# EAGLE design attiny85nightlight (EAGLE 8.1.0)
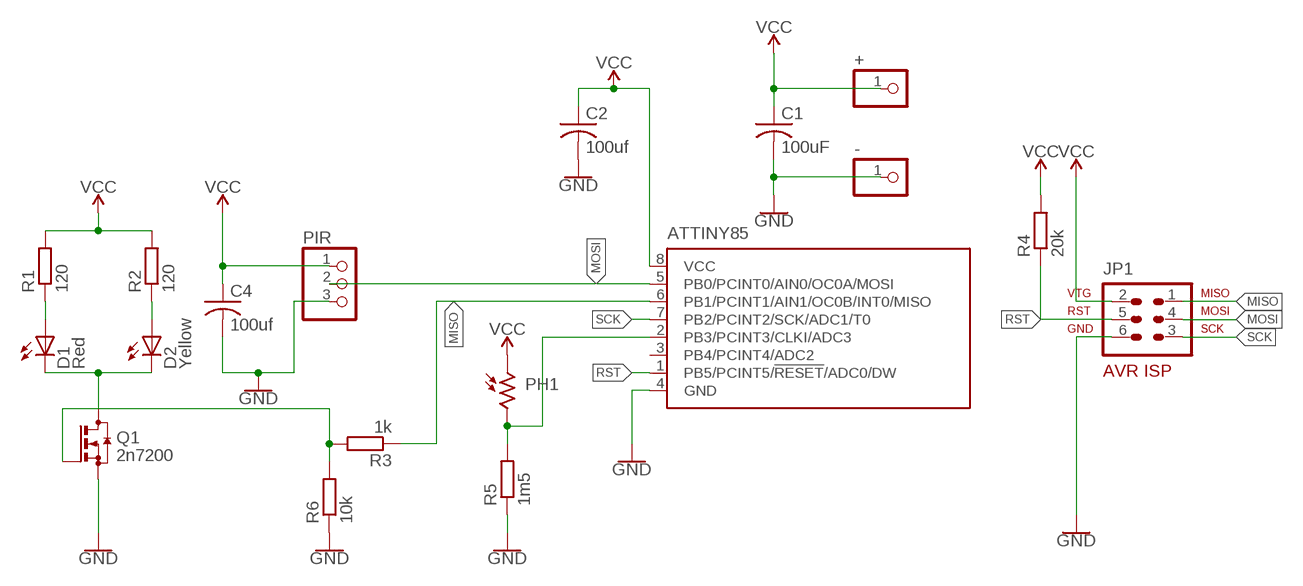
[diagram p0: schematic, sheet 1]

## Parts
+  PINHD-1X1  [1X01]
-  PINHD-1X1  [1X01]
ATTINY85  TINY13-20SU  [8S2]
C1  100uF  C-USC0805  [C0805]
C2  100uf  C-USC0805  [C0805]
C4  100uf  C-USC0805  [C0805]
D1  Red  LED5MM  [LED5MM]
D2  Yellow  LED5MM  [LED5MM]
JP1  AVR-ISP-6  [AVR-ISP-6]
PH1  A1050_09  [T0-46-A10XX]
PIR  PINHD-1X3  [1X03]
Q1  2n7200  BSS123  [SOT23]
R1  120  R-EU_R0805  [R0805]
R2  120  R-EU_R0805  [R0805]
R3  1k  R-EU_R0805  [R0805]
R4  20k  R-EU_R0805  [R0805]
R5  1m5  R-EU_R0805  [R0805]
R6  10k  R-EU_R0805  [R0805]

## Nets
GND: -.1 ATTINY85.4(GND) C1.2 C2.2 C4.2 JP1.6 PIR.3 Q1.2(S) R5.1 R6.1
MISO: ATTINY85.6(PB1/PCINT1/AIN1/OC0B/INT0/MISO) JP1.1 R3.1
MOSI: ATTINY85.5(PB0/PCINT0/AIN0/OC0A/MOSI) JP1.4 PIR.2
N$1: D1.K(C) D2.K(C) Q1.3(D)
N$3: ATTINY85.2(PB3/PCINT3/CLKI/ADC3) PH1.2 R5.2
N$5: D1.A R1.1
N$6: D2.A R2.1
N$8: Q1.1(G) R3.2 R6.2
RST: ATTINY85.1(PB5/PCINT5/!RESET!/ADC0/DW) JP1.5 R4.1
SCK: ATTINY85.7(PB2/PCINT2/SCK/ADC1/T0) JP1.3
VCC: +.1 ATTINY85.8(VCC) C1.1 C2.1 C4.1 JP1.2 PH1.1 PIR.1 R1.2 R2.2 R4.2
Unconnected: ATTINY85.3(PB4/PCINT4/ADC2)

## Library data of the parts
+ - = pinhead:PINHD-1X1: PIN HEADER
ATTINY85 = atmel:TINY13: 8-bit AVR Microcontroller with 1K Bytes In-System Programmable Flash Source: http://www.atmel.com/dyn/resources/prod_documents/2535S.pdf; MPN: ATTINY13-20SU; OC_FARNELL: 9171568; OC_NEWARK: 96K6522
C1 C2 C4 = rcl:C-US: CAPACITOR, American symbol
D1 D2 = led:LED: LED OSRAM: - CHIPLED LG R971, LG N971, LY N971, LG Q971, LY Q971, LO R971, LY R971 LH N974, LH R974 LS Q976, LO Q976, LY Q976 LO Q996 - Hyper CHIPLED LW Q18S LB Q993, LB Q99A, LB R99A - SideLED LS A670, LO A670, LY A670, LG A670, LP A670 LB A673, LV A673, LT A673, LW A673 LH A674 LY A675 LS A676, LA A676, LO A676, LY A676, LW A676 LS A679, LY A679, LG A679 - Hyper Micro SIDELED® LS Y876, LA Y876, LO Y876, LY Y876 LT Y87S - SmartLED LW L88C, LW L88S LB L89C, LB L89S, LG L890 LS L89K, LO L89K, LY L89K LS L896, LA L896, LO L896, LY L896 - TOPLED LS T670, LO T670, LY T670, LG T670, LP T670 LSG T670, LSP T670, LSY T670, LOP T670, LYG T670 LG T671, LOG T671, LSG T671 LB T673, LV T673, LT T673, LW T673 LH T674 LS T676, LA T676, LO T676, LY T676, LB T676, LH T676, LSB T676, LW T676 LB T67C, LV T67C, LT T67C, LS T67K, LO T67K, LY T67K, LW E67C LS E67B, LA E67B, LO E67B, LY E67B, LB E67C, LV E67C, LT E67C LW T67C LS T679, LY T679, LG T679 LS T770, LO T770, LY T770, LG T770, LP T770 LB T773, LV T773, LT T773, LW T773 LH T774 LS E675, LA E675, LY E675, LS T675 LS T776, LA T776, LO T776, LY T776, LB T776 LHGB T686 LT T68C, LB T68C - Hyper Mini TOPLED® LB M676 - Mini TOPLED Santana® LG M470 LS M47K, LO M47K, LY M47K Source: http://www.osram.convergy.de LUXEON: - LUMILED® LXK2-PW12-R00, LXK2-PW12-S00, LXK2-PW14-U00, LXK2-PW14-V00 LXK2-PM12-R00, LXK2-PM12-S00, LXK2-PM14-U00 LXK2-PE12-Q00, LXK2-PE12-R00, LXK2-PE12-S00, LXK2-PE14-T00, LXK2-PE14-U00 LXK2-PB12-K00, LXK2-PB12-L00, LXK2-PB12-M00, LXK2-PB14-N00, LXK2-PB14-P00, LXK2-PB14-Q00 LXK2-PR12-L00, LXK2-PR12-M00, LXK2-PR14-Q00, LXK2-PR14-R00 LXK2-PD12-Q00, LXK2-PD12-R00, LXK2-PD12-S00 LXK2-PH12-R00, LXK2-PH12-S00 LXK2-PL12-P00, LXK2-PL12-Q00, LXK2-PL12-R00 Source: www.luxeon.com KINGBRIGHT: KA-3528ASYC Source: www.kingbright.com
JP1 = atmel-1:AVR-ISP-6: AVR ISP-6 Serial Programming Header
PH1 = photo-elements:A10: Sensor Robust Light Sensing Applications Outdoor Light Sensing Application Source: http://optoelectronics.perkinelmer.com/content/Datasheets/DTS_PhotocellsA1050.pdf
PIR = pinhead:PINHD-1X3: PIN HEADER
Q1 = transistor-small-signal:BSS123: N-CHANNEL MOS FET
R1-R6 = resistor:R-EU_: RESISTOR, European symbol

## Board
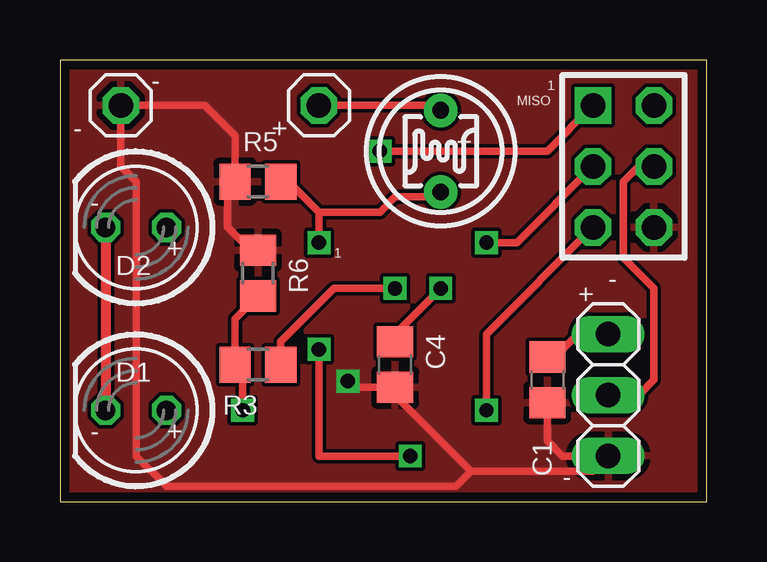
[diagram p1: board, top side]
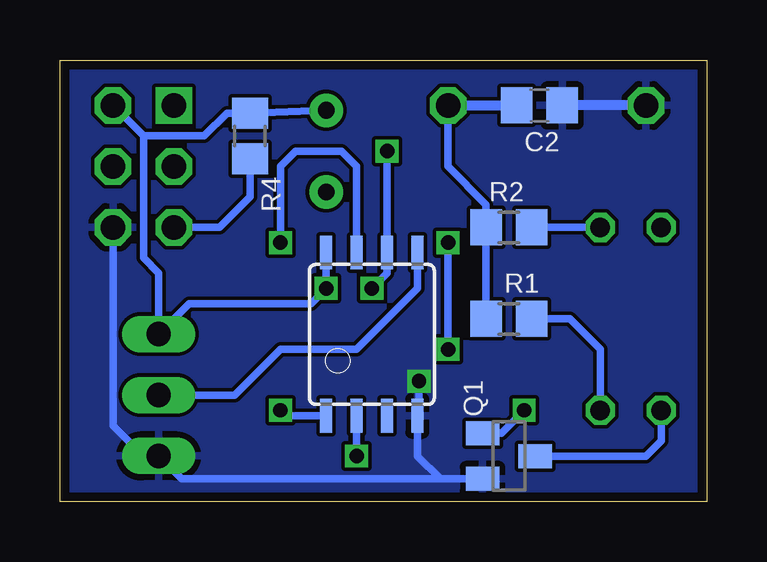
[diagram p2: board, bottom side, seen from below]

Size 26.98 x 18.4 mm. Coordinates in mm from the lower left corner, seen from the top.
Outline: 0,0 26.98,0 26.98,18.4 0,18.4 0,0
Copper layers (1*16): Top 0.0356mm / dielectric 1.5011mm / Bottom 0.0356mm
Design rules "LaenPCBOrder": minimum track width 6mil, minimum drill 13mil, track to track 6mil, track to pad 6mil, pad to pad 6mil, via to via 6mil, smd to smd 6mil, copper to edge 15mil, drill to drill 6mil, minimum pad ring 7mil, minimum via ring 7mil, stop-mask expansion 3mil, vias tented up to drill 0mil, thermal gap 10mil

### Footprints (pad centres in the part's own frame; a part is rotated, then mirrored left to right if it is on the bottom)
1X01 = drill 1.016 octagon: 1 0,0
8S2 = smd 0.5 x 1.4: 1 -1.905,-3.404; 2 -0.645,-3.404; 3 0.625,-3.404; 4 1.895,-3.404; 5 1.905,3.404; 6 0.635,3.404; 7 -0.635,3.404; 8 -1.905,3.404
C0805 = smd 1.3 x 1.5: 1 -0.95,0; 2 0.95,0
LED5MM = drill 0.813 octagon: A -1.27,0; K 1.27,0
AVR-ISP-6 = drill 1.016 square: 1 -2.54,-1.27 | drill 1.016 octagon: 2 -2.54,1.27; 3 0,-1.27; 4 0,1.27; 5 2.54,-1.27; 6 2.54,1.27
T0-46-A10XX = drill 0.7 pad 1.4: 1 -1.7,0; 2 1.7,0
1X03 = drill 1.016 long: 1 -2.54,0; 2 0,0; 3 2.54,0
SOT23 = smd 1 x 1.4: 1 -0.95,-1.1; 2 0.95,-1.1; 3 0,1.1
R0805 = smd 1.3 x 1.5: 1 -0.95,0; 2 0.95,0

### Placement (x,y rotation side)
+  10.8,16.51 0 top
-  2.54,16.51 0 top
ATTINY85  13.97,6.98 0 bottom
C1  20.32,5.08 270 top
C2  6.98,16.51 0 bottom
C4  13.97,5.71 270 top
D1  3.18,3.81 180 top
D2  3.18,11.43 180 top
JP1  23.49,13.97 270 top
PH1  15.88,14.61 270 top
PIR  22.86,4.45 270 top
Q1  8.26,1.9 270 bottom
R1  8.26,7.62 180 bottom
R2  8.26,11.43 180 bottom
R3  8.26,5.71 180 top
R4  19.05,15.24 90 bottom
R5  8.26,13.33 0 top
R6  8.26,9.52 270 top

### Tracks (layer width: path | path; a pad name or v marks a point on that pad's centre or on a via)
GND  (via drill 0.6)
  Top 0.305: 7.3,13.97 R5.1 | 7.3,13.97 7.3,15.24 C2.2 -.1 2.54,13.97 3.18,13.33 3.18,1.9 4.45,0.63 16.51,0.63 17.14,1.27 | 20,3.81 C1.2 20.32,2.54 20.95,1.9 PIR.3 22.23,1.27 17.14,1.27 | 17.14,1.27 13.97,4.45 C4.2 12.26,4.77 v12.01,5.02 | R6.1 8.26,10.16 6.98,11.43 6.98,13.65 7.3,13.97
  Bottom 0.305: JP1.6 24.77,3.18 23.49,1.9 PIR.3 21.91,0.95 10.8,0.95 | v12.01,5.02 12.01,3.65 ATTINY85.4 | ATTINY85.4 11.98,3.58 | Q1.2 10.8,0.95 | 10.8,0.95 11.12,0.95 12.06,1.9 ATTINY85.4
  Bottom 0.406: -.1 C2.2
  pour Bottom: 0,18.42 26.67,18.42 26.67,0 0,0
  pour Top: 0,18.42 26.67,18.42 26.67,0 0,0
MISO  (via drill 0.6)
  Top 0.305: v13.34,14.61 20.32,14.61 JP1.1 | R3.1 9.2,6.66 11.43,8.89 v13.97,8.89
  Bottom 0.305: v13.34,14.61 ATTINY85.6 13.34,9.52 v13.97,8.89
MOSI
  Top 0.305: JP1.4 24.13,13.97 23.49,13.33 23.49,10.16 24.77,8.89 24.77,5.08 24.13,4.45 PIR.2
  Bottom 0.305: ATTINY85.5 12.06,8.89 14.6,6.35 17.78,6.35 19.69,4.45 PIR.2
N$1
  Top 0.406: D2.K D1.K
  Bottom 0.305: Q1.3 2.54,1.9 1.91,2.54 D1.K
N$3  (via drill 0.6)
  Top 0.305: R5.2 9.52,13.33 10.8,12.06 | 10.8,12.06 13.34,12.06 13.97,12.7 15.67,12.7 PH1.2 | 10.8,12.06 v10.8,10.79 | v10.8,6.35 10.8,1.9 v14.6,1.9
  Bottom 0.305: v10.8,10.79 v10.8,6.35 | v14.6,1.9 ATTINY85.2
N$5
  Bottom 0.305: R1.1 5.71,7.62 4.45,6.35 D1.A
N$6
  Bottom 0.305: R2.1 D2.A
N$8  (via drill 0.6)
  Top 0.305: v7.62,3.81 7.62,5.4 R3.2 7.3,7.62 R6.2
  Bottom 0.305: Q1.1 8.58,2.86 v7.62,3.81
RST  (via drill 0.6)
  Top 0.305: v17.78,3.81 17.78,6.98 JP1.5
  Bottom 0.305: R4.1 19.05,12.7 20.32,11.43 JP1.5 | ATTINY85.1 17.55,3.58 v17.78,3.81
SCK  (via drill 0.6)
  Top 0.305: v17.78,10.79 19.05,10.79 JP1.3
  Bottom 0.305: ATTINY85.7 14.6,13.97 15.24,14.61 17.14,14.61 17.78,13.97 v17.78,10.79
VCC  (via drill 0.6)
  Top 0.305: +.1 15.67,16.51 PH1.1 | C1.1 20.63,6.03 21.59,6.98 PIR.1 | C4.1 13.97,6.98 v15.88,8.89
  Bottom 0.305: R1.2 R2.2 9.2,12.38 10.8,13.97 +.1 | PH1.1 R4.2 20.01,16.19 20.95,15.24 23.49,15.24 | 23.49,15.24 JP1.2 | 23.49,15.24 23.49,10.16 22.86,9.52 PIR.1 21.59,8.25 16.51,8.25 v15.88,8.89 ATTINY85.8
  Bottom 0.406: +.1 C2.1

### Text on the board
tNames: - | MISO | 1 | + | - | + | 1 | - | + | - | + | -